# EAGLE schematic UCirKitUserStudy5 (EAGLE 7.3.0)
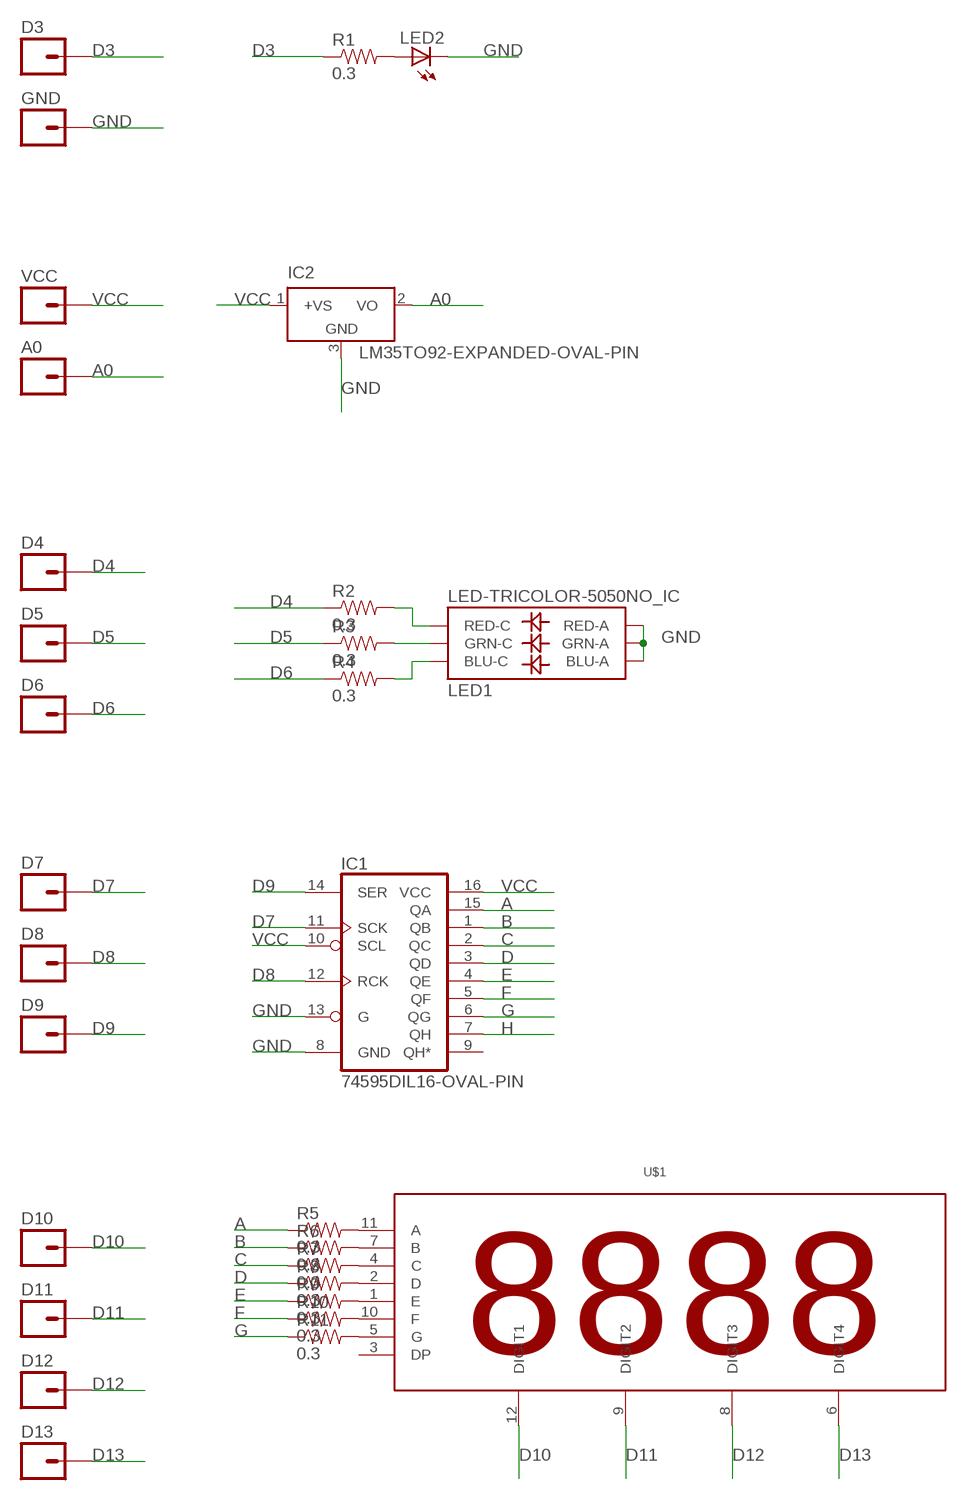
[diagram p0: schematic, sheet 1]

## Parts
A0  M01OVAL_PIN  [1X01_OVAL_PIN]
D3  M01OVAL_PIN  [1X01_OVAL_PIN]
D4  M01OVAL_PIN  [1X01_OVAL_PIN]
D5  M01OVAL_PIN  [1X01_OVAL_PIN]
D6  M01OVAL_PIN  [1X01_OVAL_PIN]
D7  M01OVAL_PIN  [1X01_OVAL_PIN]
D8  M01OVAL_PIN  [1X01_OVAL_PIN]
D9  M01OVAL_PIN  [1X01_OVAL_PIN]
D10  M01OVAL_PIN  [1X01_OVAL_PIN]
D11  M01OVAL_PIN  [1X01_OVAL_PIN]
D12  M01OVAL_PIN  [1X01_OVAL_PIN]
D13  M01OVAL_PIN  [1X01_OVAL_PIN]
GND  M01OVAL_PIN  [1X01_OVAL_PIN]
IC1  74595DIL16-OVAL-PIN  [DIL16-OVAL-PIN]
IC2  LM35TO92-EXPANDED-OVAL-PIN  [TO92-EXPANDED-OVAL-PIN]
LED1  LED-TRICOLOR-5050NO_IC  [LED-TRICOLOR-5050]
LED2  LEDCHIP-LED0805  [CHIP-LED0805]
R1  0.3  0.3OHM-1/8W-1%(0805)  [0805]
R2  0.3  0.3OHM-1/8W-1%(0805)  [0805]
R3  0.3  0.3OHM-1/8W-1%(0805)  [0805]
R4  0.3  0.3OHM-1/8W-1%(0805)  [0805]
R5  0.3  0.3OHM-1/8W-1%(0805)  [0805]
R6  0.3  0.3OHM-1/8W-1%(0805)  [0805]
R7  0.3  0.3OHM-1/8W-1%(0805)  [0805]
R8  0.3  0.3OHM-1/8W-1%(0805)  [0805]
R9  0.3  0.3OHM-1/8W-1%(0805)  [0805]
R10  0.3  0.3OHM-1/8W-1%(0805)  [0805]
R11  0.3  0.3OHM-1/8W-1%(0805)  [0805]
U$1  4DIGIT_SEVEN_SEGMENT4DIGIT_SEVEN_SEGMENT_OVAL_PIN  [4DIGIT_SEVEN_SEGMENT_OVAL_PIN]
VCC  M01OVAL_PIN  [1X01_OVAL_PIN]

## Nets
A: IC1.15(QA) R5.1
A0: A0.1 IC2.2(VO)
B: IC1.1(QB) R6.1
C: IC1.2(QC) R7.1
D: IC1.3(QD) R8.1
D3: D3.1 R1.1
D4: D4.1 R2.1
D5: D5.1 R3.1
D6: D6.1 R4.1
D7: D7.1 IC1.11(SCK)
D8: D8.1 IC1.12(RCK)
D9: D9.1 IC1.14(SER)
D10: D10.1 U$1.12(DIGIT1)
D11: D11.1 U$1.9(DIGIT2)
D12: D12.1 U$1.8(DIGIT3)
D13: D13.1 U$1.6(DIGIT4)
E: IC1.4(QE) R9.1
F: IC1.5(QF) R10.1
G: IC1.6(QG) R11.1
GND: GND.1 IC1.8(GND) IC1.13(G) IC2.3(GND) LED1.1(GRN-A) LED1.2(RED-A) LED1.3(BLU-A) LED2.C
H: IC1.7(QH)
N$1: R5.2 U$1.11(A)
N$2: R6.2 U$1.7(B)
N$3: R7.2 U$1.4(C)
N$4: R8.2 U$1.2(D)
N$5: R9.2 U$1.1(E)
N$6: R10.2 U$1.10(F)
N$7: R11.2 U$1.5(G)
N$8: LED1.5(RED-C) R2.2
N$9: LED1.6(GRN-C) R3.2
N$10: LED1.4(BLU-C) R4.2
N$11: LED2.A R1.2
VCC: IC1.10(SCL) IC1.16(VCC) IC2.1(+VS) VCC.1
Unconnected: IC1.9(QH*) U$1.3(DP)

## Library data of the parts
A0 D3-D13 GND VCC = SparkFun-Connectors:M01: Header 1 Standard 1-pin 0.1" header. Use with straight break away headers (SKU : PRT-00116), right angle break away headers (PRT-00553), swiss pins (PRT-00743), machine pins (PRT-00117), and female headers (PRT-00115).
IC1 = SparkFun-DigitalIC:74*595: 8-bit SHIFT REGISTER, output latch
IC2 = lm35:LM35: Single-Supply Centigrade Temperature Sensor Vout = (10mV/°C x Temp °C) +5mmmV Source: http://www.national.com/ds/LM/LM35.pdf
LED1 = SparkFun-LED:LED-TRICOLOR-5050
LED2 = led:LED: LED OSRAM: - CHIPLED LG R971, LG N971, LY N971, LG Q971, LY Q971, LO R971, LY R971 LH N974, LH R974 LS Q976, LO Q976, LY Q976 LO Q996 - Hyper CHIPLED LW Q18S LB Q993, LB Q99A, LB R99A - SideLED LS A670, LO A670, LY A670, LG A670, LP A670 LB A673, LV A673, LT A673, LW A673 LH A674 LY A675 LS A676, LA A676, LO A676, LY A676, LW A676 LS A679, LY A679, LG A679 - Hyper Micro SIDELED® LS Y876, LA Y876, LO Y876, LY Y876 LT Y87S - SmartLED LW L88C, LW L88S LB L89C, LB L89S, LG L890 LS L89K, LO L89K, LY L89K LS L896, LA L896, LO L896, LY L896 - TOPLED LS T670, LO T670, LY T670, LG T670, LP T670 LSG T670, LSP T670, LSY T670, LOP T670, LYG T670 LG T671, LOG T671, LSG T671 LB T673, LV T673, LT T673, LW T673 LH T674 LS T676, LA T676, LO T676, LY T676, LB T676, LH T676, LSB T676, LW T676 LB T67C, LV T67C, LT T67C, LS T67K, LO T67K, LY T67K, LW E67C LS E67B, LA E67B, LO E67B, LY E67B, LB E67C, LV E67C, LT E67C LW T67C LS T679, LY T679, LG T679 LS T770, LO T770, LY T770, LG T770, LP T770 LB T773, LV T773, LT T773, LW T773 LH T774 LS E675, LA E675, LY E675, LS T675 LS T776, LA T776, LO T776, LY T776, LB T776 LHGB T686 LT T68C, LB T68C - Hyper Mini TOPLED® LB M676 - Mini TOPLED Santana® LG M470 LS M47K, LO M47K, LY M47K Source: http://www.osram.convergy.de LUXEON: - LUMILED® LXK2-PW12-R00, LXK2-PW12-S00, LXK2-PW14-U00, LXK2-PW14-V00 LXK2-PM12-R00, LXK2-PM12-S00, LXK2-PM14-U00 LXK2-PE12-Q00, LXK2-PE12-R00, LXK2-PE12-S00, LXK2-PE14-T00, LXK2-PE14-U00 LXK2-PB12-K00, LXK2-PB12-L00, LXK2-PB12-M00, LXK2-PB14-N00, LXK2-PB14-P00, LXK2-PB14-Q00 LXK2-PR12-L00, LXK2-PR12-M00, LXK2-PR14-Q00, LXK2-PR14-R00 LXK2-PD12-Q00, LXK2-PD12-R00, LXK2-PD12-S00 LXK2-PH12-R00, LXK2-PH12-S00 LXK2-PL12-P00, LXK2-PL12-Q00, LXK2-PL12-R00 Source: www.luxeon.com KINGBRIGHT: KA-3528ASYC Source: www.kingbright.com
R1-R11 = SparkFun-Resistors:0.3OHM-1/8W-1%(0805): RES-11622; PROD_ID: RES-11622
U$1 = led-7-segment:4DIGIT_SEVEN_SEGMENT